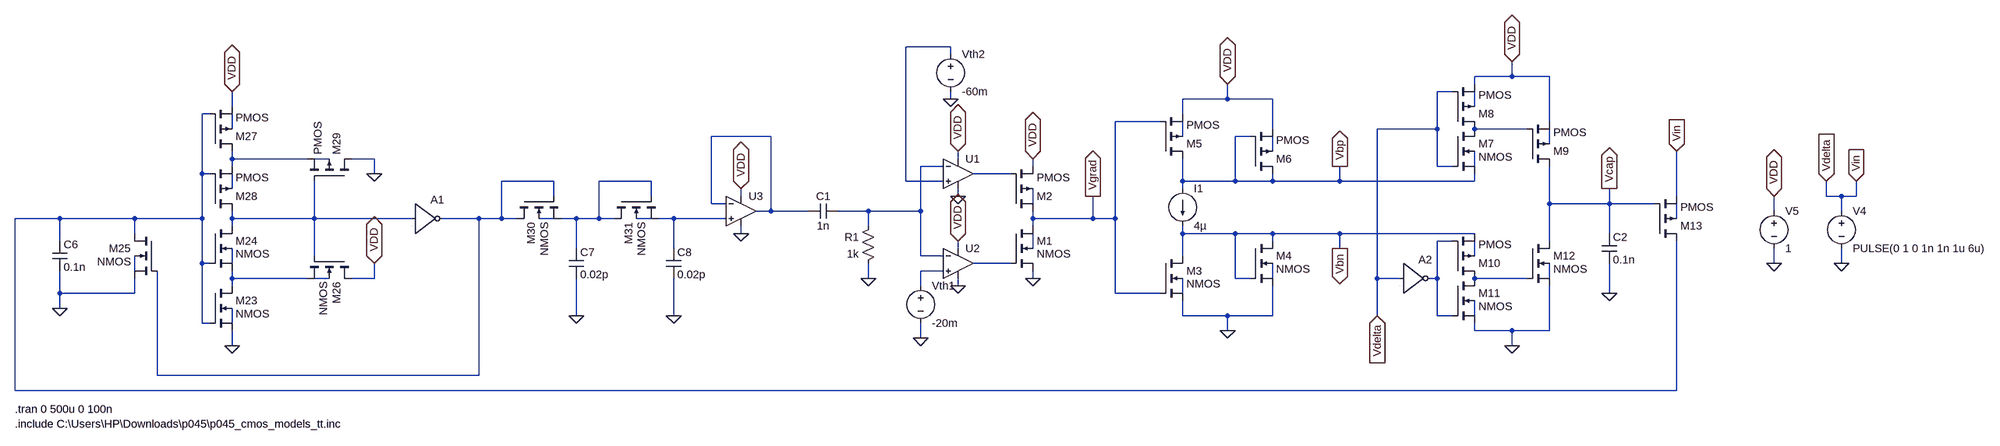
[diagram p0: schematic schematic.asc]
schematic.asc, the LTspice schematic file:
Version 4
SHEET 1 4020 1464
WIRE 1392 640 1296 640
WIRE 1392 656 1392 640
WIRE 2592 704 2592 672
WIRE 2592 704 2512 704
WIRE 2672 704 2592 704
WIRE 2512 720 2512 704
WIRE 2464 736 2432 736
WIRE 1392 752 1392 736
WIRE 1984 752 1984 720
WIRE 1984 752 1888 752
WIRE 2080 752 1984 752
WIRE -144 768 -144 736
WIRE 2512 768 2512 736
WIRE -192 784 -208 784
WIRE 1888 784 1888 752
WIRE 1840 800 1744 800
WIRE 2672 800 2672 704
WIRE -144 816 -144 784
WIRE 2080 816 2080 752
WIRE 2432 816 2432 736
WIRE 2432 816 2304 816
WIRE 2624 816 2512 816
WIRE 1008 832 880 832
WIRE 1888 832 1888 800
WIRE 2032 832 2000 832
WIRE 2672 848 2672 816
WIRE 2080 864 2080 832
WIRE -144 880 -144 864
WIRE 16 880 -144 880
WIRE 64 880 32 880
WIRE 160 880 112 880
WIRE 1408 880 1408 864
WIRE -144 896 -144 880
WIRE 1376 896 1328 896
WIRE 1568 896 1568 880
WIRE 2432 896 2432 816
WIRE 2464 896 2432 896
WIRE 2512 896 2512 864
WIRE -208 912 -208 784
WIRE -192 912 -208 912
WIRE 160 912 160 880
WIRE 1520 912 1440 912
WIRE 544 928 432 928
WIRE 752 928 640 928
WIRE 1296 928 1296 640
WIRE 1376 928 1296 928
WIRE 1888 928 1888 880
WIRE 2000 928 2000 832
WIRE 2000 928 1888 928
WIRE 2080 928 2080 912
WIRE 2080 928 2000 928
WIRE 2224 928 2224 896
WIRE 2224 928 2080 928
WIRE 2512 928 2512 912
WIRE 2512 928 2224 928
WIRE -144 944 -144 912
WIRE 1888 944 1888 928
WIRE 544 960 544 928
WIRE 752 960 752 928
WIRE 944 960 944 944
WIRE 1408 960 1408 944
WIRE 2944 960 2944 864
WIRE 3264 960 3264 928
WIRE 3296 960 3264 960
WIRE 3328 960 3328 928
WIRE 3328 960 3296 960
WIRE 880 976 880 832
WIRE 912 976 880 976
WIRE 1568 976 1568 944
WIRE 2672 976 2672 896
WIRE 2800 976 2800 944
WIRE 2800 976 2672 976
WIRE 2896 976 2800 976
WIRE 1008 992 1008 832
WIRE 1008 992 976 992
WIRE 1088 992 1008 992
WIRE 1216 992 1152 992
WIRE 1328 992 1328 896
WIRE 1328 992 1216 992
WIRE 3152 992 3152 960
WIRE 3296 992 3296 960
WIRE -512 1008 -608 1008
WIRE -352 1008 -512 1008
WIRE -208 1008 -208 912
WIRE -208 1008 -352 1008
WIRE -144 1008 -144 992
WIRE 32 1008 32 928
WIRE 32 1008 -144 1008
WIRE 240 1008 32 1008
WIRE 384 1008 304 1008
WIRE 432 1008 432 928
WIRE 432 1008 384 1008
WIRE 464 1008 432 1008
WIRE 544 1008 512 1008
WIRE 592 1008 560 1008
WIRE 640 1008 640 928
WIRE 640 1008 592 1008
WIRE 672 1008 640 1008
WIRE 752 1008 720 1008
WIRE 800 1008 768 1008
WIRE 912 1008 800 1008
WIRE 1568 1008 1568 992
WIRE 1696 1008 1696 960
WIRE 1696 1008 1568 1008
WIRE 1744 1008 1744 800
WIRE 1744 1008 1696 1008
WIRE 2944 1008 2944 976
WIRE -144 1024 -144 1008
WIRE 1216 1024 1216 992
WIRE 1568 1024 1568 1008
WIRE -352 1040 -352 1008
WIRE 944 1040 944 1024
WIRE 1888 1040 1888 1024
WIRE 2000 1040 1888 1040
WIRE 2080 1040 2000 1040
WIRE 2224 1040 2080 1040
WIRE 2512 1040 2224 1040
WIRE 2800 1040 2800 976
WIRE -512 1056 -512 1008
WIRE 2080 1056 2080 1040
WIRE 2464 1056 2432 1056
WIRE 2672 1056 2672 976
WIRE 592 1072 592 1008
WIRE 800 1072 800 1008
WIRE 1408 1072 1408 1056
WIRE 1568 1072 1568 1040
WIRE 2224 1072 2224 1040
WIRE 32 1088 32 1008
WIRE 1328 1088 1328 992
WIRE 1376 1088 1328 1088
WIRE 1888 1088 1888 1040
WIRE 2512 1088 2512 1056
WIRE -208 1104 -208 1008
WIRE -192 1104 -208 1104
WIRE -144 1104 -144 1072
WIRE 1520 1104 1440 1104
WIRE 3152 1104 3152 1072
WIRE 3296 1104 3296 1072
WIRE -352 1120 -352 1088
WIRE 1376 1120 1328 1120
WIRE -144 1136 -144 1120
WIRE 16 1136 -144 1136
WIRE 64 1136 32 1136
WIRE 160 1136 160 1104
WIRE 160 1136 112 1136
WIRE 1216 1136 1216 1104
WIRE 1568 1136 1568 1120
WIRE 2000 1136 2000 1040
WIRE 2032 1136 2000 1136
WIRE 2080 1136 2080 1104
WIRE 2304 1136 2304 816
WIRE 2352 1136 2304 1136
WIRE 2432 1136 2432 1056
WIRE 2432 1136 2416 1136
WIRE 2624 1136 2512 1136
WIRE 2672 1136 2672 1104
WIRE -144 1152 -144 1136
WIRE 1328 1152 1328 1120
WIRE 1408 1152 1408 1136
WIRE -512 1168 -512 1120
WIRE -352 1168 -352 1136
WIRE -352 1168 -512 1168
WIRE 1744 1168 1744 1008
WIRE 1840 1168 1744 1168
WIRE 1888 1168 1888 1136
WIRE 2800 1168 2800 1104
WIRE -512 1200 -512 1168
WIRE 592 1216 592 1136
WIRE 800 1216 800 1136
WIRE 1888 1216 1888 1184
WIRE 1984 1216 1888 1216
WIRE 2080 1216 2080 1152
WIRE 2080 1216 1984 1216
WIRE 2304 1216 2304 1136
WIRE 2432 1216 2432 1136
WIRE 2464 1216 2432 1216
WIRE 2512 1216 2512 1184
WIRE -208 1232 -208 1104
WIRE -192 1232 -208 1232
WIRE -144 1232 -144 1200
WIRE 1984 1248 1984 1216
WIRE 2512 1248 2512 1232
WIRE 2592 1248 2512 1248
WIRE 2672 1248 2672 1152
WIRE 2672 1248 2592 1248
WIRE 1328 1264 1328 1232
WIRE -144 1280 -144 1248
WIRE 2592 1280 2592 1248
WIRE -304 1344 -304 1120
WIRE 384 1344 384 1008
WIRE 384 1344 -304 1344
WIRE -608 1376 -608 1008
WIRE 2944 1376 2944 1056
WIRE 2944 1376 -608 1376
FLAG 3152 1104 0
FLAG 3152 960 VDD
IOPIN 3152 960 BiDir
FLAG -512 1200 0
FLAG 160 912 0
FLAG 160 1104 VDD
IOPIN 160 1104 BiDir
FLAG -144 1280 0
FLAG -144 736 VDD
IOPIN -144 736 BiDir
FLAG 592 1216 0
FLAG 800 1216 0
FLAG 1216 1136 0
FLAG 944 1040 0
FLAG 944 944 VDD
IOPIN 944 944 BiDir
FLAG 1328 1264 0
FLAG 1392 752 0
FLAG 1408 960 0
FLAG 1408 1152 0
FLAG 1408 1056 VDD
IOPIN 1408 1056 BiDir
FLAG 1408 864 VDD
IOPIN 1408 864 BiDir
FLAG 1568 1136 0
FLAG 1568 880 VDD
IOPIN 1568 880 BiDir
FLAG 1984 1248 0
FLAG 1984 720 VDD
IOPIN 1984 720 BiDir
FLAG 2224 896 Vbp
IOPIN 2224 896 Out
FLAG 2224 1072 Vbn
IOPIN 2224 1072 Out
FLAG 1696 960 Vgrad
IOPIN 1696 960 Out
FLAG 2592 672 VDD
IOPIN 2592 672 BiDir
FLAG 2592 1280 0
FLAG 2800 1168 0
FLAG 2304 1216 Vdelta
IOPIN 2304 1216 In
FLAG 2944 864 Vin
IOPIN 2944 864 In
FLAG 3296 1104 0
FLAG 3264 928 Vdelta
IOPIN 3264 928 In
FLAG 3328 928 Vin
IOPIN 3328 928 In
FLAG 2800 944 Vcap
IOPIN 2800 944 Out
SYMBOL voltage 3152 976 R0
WINDOW 123 0 0 Left 0
WINDOW 39 0 0 Left 0
SYMATTR InstName V5
SYMATTR Value 1
SYMBOL cap -528 1056 R0
SYMATTR InstName C6
SYMATTR Value 0.1n
SYMATTR SpiceLine V=25 Irms=0 Rser=0 Lser=380p Rpar=0
SYMBOL Digital\\inv 240 944 R0
SYMATTR InstName A1
SYMBOL nmos4 -192 1152 R0
WINDOW 3 56 60 Left 2
SYMATTR InstName M23
SYMATTR Value2 l=0.05u w=0.25u
SYMBOL nmos4 -192 1024 R0
WINDOW 3 56 60 Left 2
SYMATTR InstName M24
SYMATTR Value2 l=0.05u w=0.25u
SYMBOL nmos4 -304 1040 M0
WINDOW 3 56 60 Left 2
SYMATTR InstName M25
SYMATTR Value2 l=0.05u w=0.1u
SYMBOL nmos4 112 1088 R90
WINDOW 3 56 60 Left 2
SYMATTR InstName M26
SYMATTR Value2 l=0.05u w=0.25u
SYMBOL pmos4 -192 864 M180
SYMATTR InstName M27
SYMATTR Value2 l=0.05u w=2u
SYMBOL pmos4 -192 992 M180
SYMATTR InstName M28
SYMATTR Value2 l=0.05u w=2u
SYMBOL pmos4 112 928 M270
SYMATTR InstName M29
SYMATTR Value2 l=0.05u w=2u
SYMBOL cap 576 1072 R0
SYMATTR InstName C7
SYMATTR Value 0.02p
SYMBOL cap 784 1072 R0
SYMATTR InstName C8
SYMATTR Value 0.02p
SYMBOL nmos4 464 960 M90
WINDOW 3 56 60 Left 2
SYMATTR InstName M30
SYMATTR Value2 l=0.05u w=1u
SYMBOL nmos4 672 960 M90
WINDOW 3 56 60 Left 2
SYMATTR InstName M31
SYMATTR Value2 l=0.05u w=1u
SYMBOL cap 1152 976 R90
WINDOW 0 0 32 VBottom 2
WINDOW 3 32 32 VTop 2
SYMATTR InstName C1
SYMATTR Value 1n
SYMBOL res 1232 1008 M0
SYMATTR InstName R1
SYMATTR Value 1k
SYMBOL OpAmps\\UniversalOpAmp 944 992 R0
SYMATTR InstName U3
SYMBOL voltage 1328 1136 R0
WINDOW 123 0 0 Left 0
WINDOW 39 0 0 Left 0
SYMATTR InstName Vth1
SYMATTR Value -20m
SYMBOL voltage 1392 640 R0
WINDOW 123 0 0 Left 0
WINDOW 39 0 0 Left 0
SYMATTR InstName Vth2
SYMATTR Value -60m
SYMBOL OpAmps\\UniversalOpAmp2 1408 912 R0
SYMATTR InstName U1
SYMBOL OpAmps\\UniversalOpAmp2 1408 1104 R0
SYMATTR InstName U2
SYMBOL nmos4 1520 1024 R0
WINDOW 3 56 60 Left 2
SYMATTR InstName M1
SYMATTR Value2 l=0.05u w=2u
SYMBOL pmos4 1520 992 M180
SYMATTR InstName M2
SYMATTR Value2 l=0.05u w=0.1u
SYMBOL current 1888 944 R0
WINDOW 123 0 0 Left 0
WINDOW 39 0 0 Left 0
SYMATTR InstName I1
SYMATTR Value 4µ
SYMBOL nmos4 1840 1088 R0
WINDOW 3 56 60 Left 2
SYMATTR InstName M3
SYMATTR Value2 l=0.05u w=2u
SYMBOL nmos4 2032 1056 R0
WINDOW 3 56 60 Left 2
SYMATTR InstName M4
SYMATTR Value2 l=0.05u w=1u
SYMBOL pmos4 1840 880 M180
SYMATTR InstName M5
SYMATTR Value2 l=0.05u w=2u
SYMBOL pmos4 2032 912 M180
SYMATTR InstName M6
SYMATTR Value2 l=0.05u w=0.1u
SYMBOL Digital\\inv 2352 1072 R0
SYMATTR InstName A2
SYMBOL cap 2784 1040 R0
SYMATTR InstName C2
SYMATTR Value 0.1n
SYMBOL nmos4 2464 816 R0
WINDOW 3 56 60 Left 2
SYMATTR InstName M7
SYMATTR Value2 l=0.05u w=5u
SYMBOL pmos4 2464 816 M180
SYMATTR InstName M8
SYMATTR Value2 l=0.05u w=5u
SYMBOL pmos4 2624 896 M180
SYMATTR InstName M9
SYMATTR Value2 l=0.05u w=1u
SYMBOL pmos4 2464 1136 M180
SYMATTR InstName M10
SYMATTR Value2 l=0.05u w=5u
SYMBOL nmos4 2464 1136 R0
WINDOW 3 56 60 Left 2
SYMATTR InstName M11
SYMATTR Value2 l=0.05u w=5u
SYMBOL nmos4 2624 1056 R0
WINDOW 3 56 60 Left 2
SYMATTR InstName M12
SYMATTR Value2 l=0.05u w=3u
SYMBOL pmos4 2896 1056 M180
SYMATTR InstName M13
SYMATTR Value2 l=0.05u w=10u
SYMBOL voltage 3296 976 R0
WINDOW 123 0 0 Left 0
WINDOW 39 0 0 Left 0
SYMATTR InstName V4
SYMATTR Value PULSE(0 1 0 1n 1n 1u 6u)
TEXT -608 1448 Left 2 !.include C:\\Users\\HP\\Downloads\\p045\\p045_cmos_models_tt.inc
TEXT -608 1416 Left 2 !.tran 0 500u 0 100n

The netlist it stands for:
* schematic.asc
V5 VDD 0 1
C6 N003 0 0.1n V=25 Irms=0 Rser=0 Lser=380p Rpar=0
A1 N019 0 0 0 0 N015 0 0 BUF
M23 N031 N003 0 N038 NMOS l=0.05u w=0.25u
M24 N019 N003 N031 N027 NMOS l=0.05u w=0.25u
M25 N003 N015 0 N029 NMOS l=0.05u w=0.1u
M26 VDD N019 N031 N032 NMOS l=0.05u w=0.25u
M27 N010 N003 VDD N004 PMOS l=0.05u w=2u
M28 N019 N003 N010 N017 PMOS l=0.05u w=2u
M29 0 N019 N010 N011 PMOS l=0.05u w=2u
C7 N016 0 0.02p
C8 N022 0 0.02p
M30 N015 N015 N016 N020 NMOS l=0.05u w=1u
M31 N016 N016 N022 N021 NMOS l=0.05u w=1u
C1 N012 N006 1n
R1 N012 0 1k
XU3 N022 N006 VDD 0 N006 level1 Avol=1Meg GBW=10Meg Vos=0 En=0 Enk=0 In=0 Ink=0 Rin=500Meg  ; pins In+ In- V+ V- OUT
Vth1 N030 0 -20m
Vth2 N001 0 -60m
XU1 N001 N012 VDD 0 N014 level2 Avol=1Meg GBW=10Meg Slew=10Meg Ilimit=25m Rail=0 Vos=0 En=0 Enk=0 In=0 Ink=0 Rin=500Meg  ; pins In+ In- V+ V- OUT
XU2 N030 N012 VDD 0 N028 level2 Avol=1Meg GBW=10Meg Slew=10Meg Ilimit=25m Rail=0 Vos=0 En=0 Enk=0 In=0 Ink=0 Rin=500Meg  ; pins In+ In- V+ V- OUT
M1 Vgrad N028 0 N025 NMOS l=0.05u w=2u
M2 Vgrad N014 VDD N018 PMOS l=0.05u w=0.1u
I1 Vbp Vbn 4µ
M3 Vbn Vgrad 0 N036 NMOS l=0.05u w=2u
M4 Vbn Vbn 0 N033 NMOS l=0.05u w=1u
M5 Vbp Vgrad VDD N007 PMOS l=0.05u w=2u
M6 Vbp Vbp VDD N009 PMOS l=0.05u w=0.1u
A2 Vin 0 0 0 0 N024 0 0 BUF
C2 Vcap 0 0.1n
M7 N005 Vin Vbp N013 NMOS l=0.05u w=5u
M8 N005 Vin VDD N002 PMOS l=0.05u w=5u
M9 Vcap N005 VDD N008 PMOS l=0.05u w=1u
M10 N034 N024 Vbn N026 PMOS l=0.05u w=5u
M11 N034 N024 0 N037 NMOS l=0.05u w=5u
M12 Vcap N034 0 N035 NMOS l=0.05u w=3u
M13 N003 Vcap Vin N023 PMOS l=0.05u w=10u
V4 Vin 0 PULSE(0 1 0 1n 1n 1u 6u)
.model NMOS NMOS
.model PMOS PMOS
.lib standard.mos
.include C:\Users\HP\Downloads\p045\p045_cmos_models_tt.inc
.tran 0 500u 0 100n
.lib UniversalOpAmp1.lib
.lib UniversalOpAmp2.lib
.backanno
.end